# Altium schematic sheet 3_PWR.schdoc
size 309 x 223 mm; Symbol: Sheet-Symbol_A4; Device: Sheet-Symbol_A4; Company: EasyEDA.com; Drawed: EasyEDA Pro; Reviewed: EasyEDA Pro; Version: V0.1; Page Size: A4; @Project Name: Robomama_ver000; @Page Count: 5; @Update Date: 2024-01-30; @Create Date: 2024-01-06; @Schematic Name: Robomama_Schematic; Part Number: JLCPCB-002; @Page No: 3; @Page Name: PWR
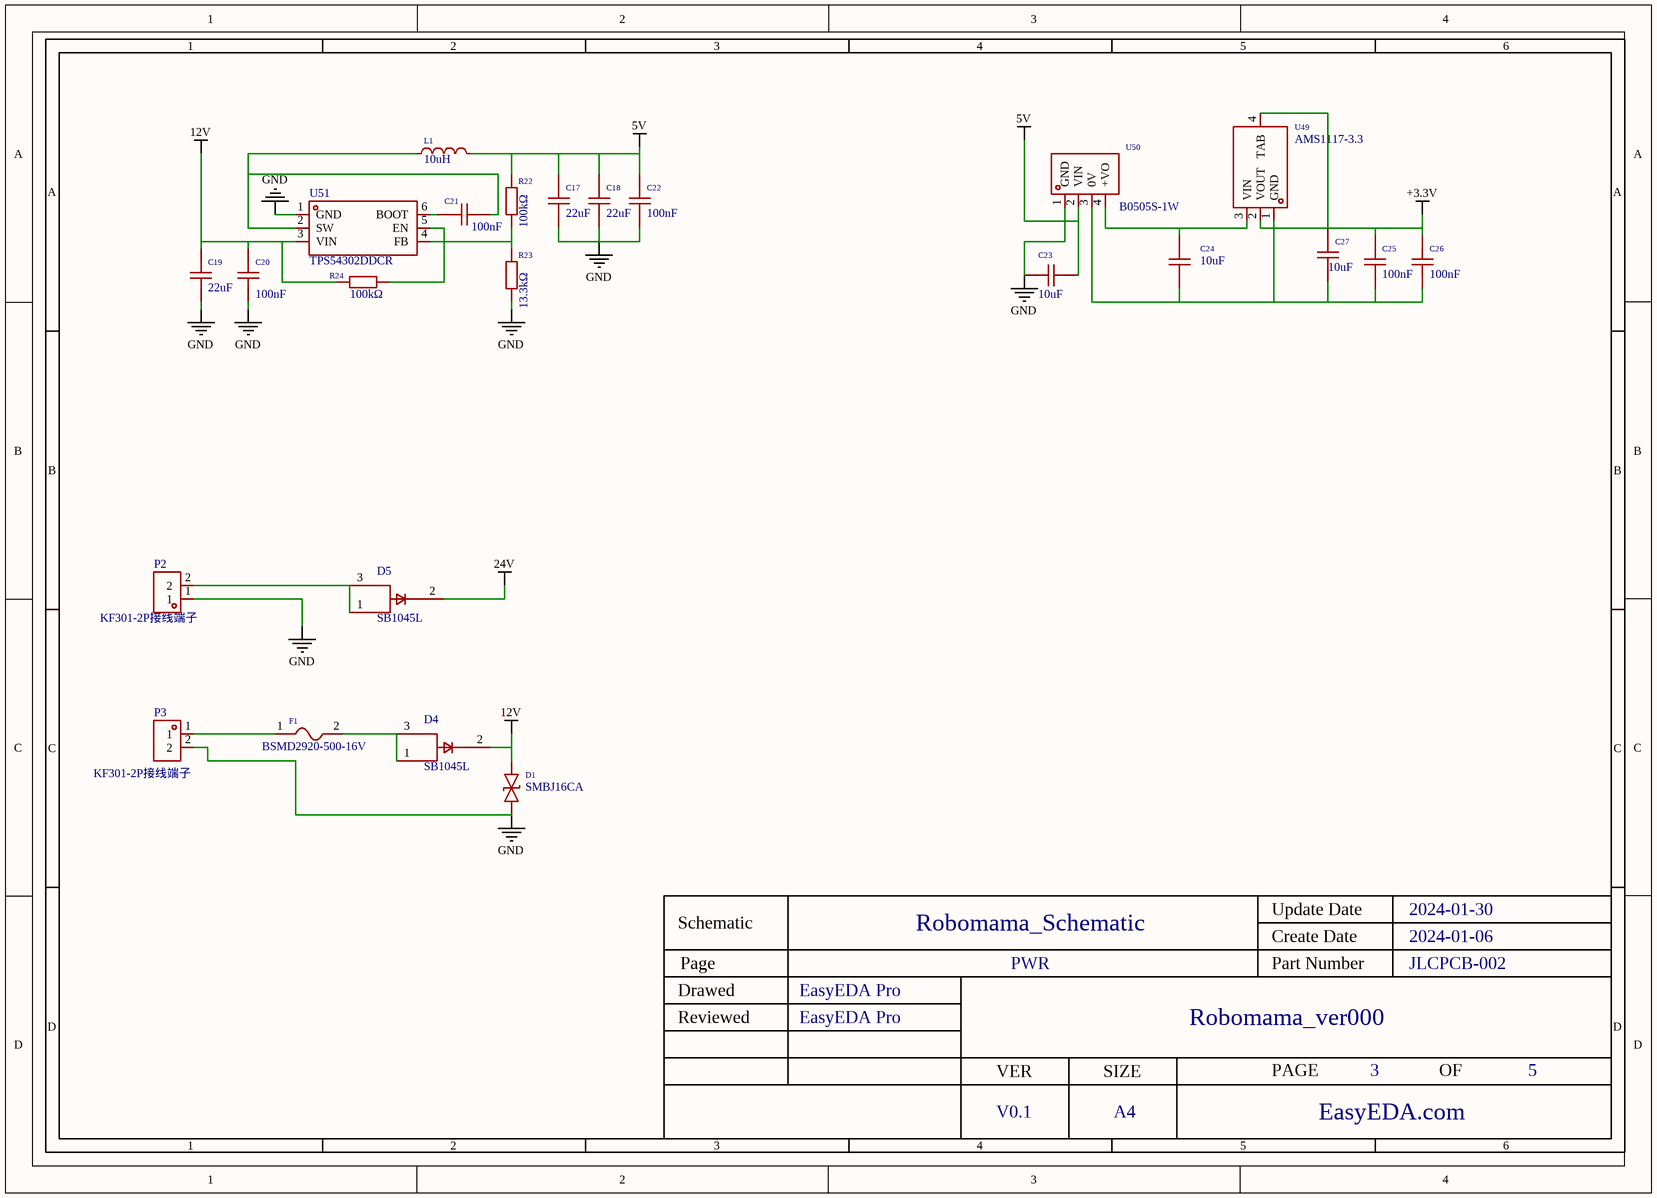
[diagram p0: 3_PWR.schdoc]

## Parts
C17  22uF  [C0805]  (value not drawn)
C18  22uF  [C0805]  (value not drawn)
C19  22uF  [C0805]  (value not drawn)
C20  100nF  [C0603]  (value not drawn)
C21  100nF  [C0603]  (value not drawn)
C22  100nF  [C0603]  (value not drawn)
C23  10uF  [C0603]  (value not drawn)
C24  10uF  [C0603]  (value not drawn)
C25  100nF  [C0603]  (value not drawn)
C26  100nF  [C0603]  (value not drawn)
C27  10uF  [C0603]  (value not drawn)
D1  SMBJ16CA  [SMB_L4.3-W3.6-LS5.4-BI]  (value not drawn)
D4  SB1045L  [TO-277_3P-L5.4-W4.0-LS6.5-TR]  (value not drawn)
D5  SB1045L  [TO-277_3P-L5.4-W4.0-LS6.5-TR]  (value not drawn)
F1  BSMD2920-500-16V  [F2920]  (value not drawn)
L1  10uH  [IND-SMD_L7.3-W6.8]  (value not drawn)
P2  KF301-2P接线端子  [CONN-TH_XY301V-A-5.0-2P]  (value not drawn)
P3  KF301-2P接线端子  [CONN-TH_XY301V-A-5.0-2P]  (value not drawn)
R22  100kΩ  [R0603]  (value not drawn)
R23  13.3kΩ  [R0603]  (value not drawn)
R24  100kΩ  [R0603]  (value not drawn)
U49  AMS1117-3.3  [SOT-223-3_L6.5-W3.4-P2.30-LS7.0-BR]  (value not drawn)
U50  B0505S-1W  [PWRM-TH_B0505S-1W]  (value not drawn)
U51  TPS54302DDCR  [SOT-23-6_L2.9-W1.6-P0.95-LS2.8-BL]  (value not drawn)

## Nets
5V: C17.2 C18.1 C22.1 C23.1 L1.2 R22.2 U50.2(VIN)
12V: C19.2 C20.2 D1.2 D4.2(K) R24.2 U51.3(VIN)
24V: D5.2(K)
+3.3V: C25.1 C26.1 C27.2 U49.2(VOUT) U49.4(TAB)
GND: C17.1 C18.2 C19.1 C20.1 C22.2 C23.2 D1.1 P2.1 P3.2 R23.1 U50.1(GND) U51.1(GND)
NetC21_1: C21.1 L1.1 U51.2(SW)
NetC21_2: C21.2 U51.6(BOOT)
NetC24_1: C24.1 C25.2 C26.2 C27.1 U49.1(GND) U50.3(0V)
NetC24_2: C24.2 U49.3(VIN) U50.4(+VO)
NetD4_1: D4.1(A) D4.3(A) F1.2
NetD5_1: D5.1(A) D5.3(A) P2.2
NetF1_1: F1.1 P3.1
NetR22_1: R22.1 R23.2 U51.4(FB)
NetR24_1: R24.1 U51.5(EN)

## Notes on the sheet
- 1
- 2
- 3
- 4
- 5
- 6
- A
- B
- C
- Schematic
- Robomama_Schematic
- Create Date
- Update Date
- 2024-01-30
- 2024-01-06
- Reviewed
- Drawed
- Page
- EasyEDA Pro
- PWR
- Part Number
- Robomama_ver000
- JLCPCB-002
- D
- VER
- SIZE
- PAGE
- OF
- V0.1
- A4
- EasyEDA.com

## Library data of the parts
C17-C19 = CL21A226MAQNNNE_C45783: Capacitance: Tolerance:±20% Tolerance:±20% Voltage Rated: Temperature Coefficient:; Manufacturer: SAMSUNG(三星); Add into BOM: yes; Tolerance: ±20%; Symbol: CL21A226MAQNNNE; Device: CL21A226MAQNNNE_C45783; Supplier: LCSC; Manufacturer Part: CL21A226MAQNNNE; Value: 22uF; Supplier Part: C45783; JLCPCB Part Class: Basic Part; LCSC Part Name: 22uF ±20% 25V; Supplier Footprint: 0805; Datasheet: https://atta.szlcsc.com/upload/public/pdf/source/20160218/1457707763339.pdf; Convert to PCB: yes
C20-C22 C25 C26 = CC0603KRX7R9BB104: Capacitance: Tolerance:±10% Tolerance:±10% Voltage Rated: Temperature Coefficient:; Manufacturer: YAGEO(国巨); Add into BOM: yes; Tolerance: ±10%; Symbol: CC0603KRX7R9BB104; Device: CC0603KRX7R9BB104; Supplier: LCSC; Manufacturer Part: CC0603KRX7R9BB104; Value: 100nF; Supplier Part: C14663; JLCPCB Part Class: Basic Part; LCSC Part Name: 100nF ±10% 50V; Supplier Footprint: 0603; Datasheet: https://atta.szlcsc.com/upload/public/pdf/source/20180910/C282072_33301C7F631E79921B82A8DAC6BCC5B3.pdf; Convert to PCB: yes
C23 C24 C27 = CL10A106KP8NNNC: Capacitance: Tolerance:±10% Tolerance:±10% Voltage Rated: Temperature Coefficient:; Manufacturer: SAMSUNG(三星); Add into BOM: yes; Tolerance: ±10%; Symbol: CL10A106KP8NNNC; Device: CL10A106KP8NNNC; Supplier: LCSC; Manufacturer Part: CL10A106KP8NNNC; Value: 10uF; Supplier Part: C19702; JLCPCB Part Class: Basic Part; LCSC Part Name: 10uF ±10% 10V; Supplier Footprint: 0603; Datasheet: https://atta.szlcsc.com/upload/public/pdf/source/20160218/1457707763339.pdf; Convert to PCB: yes
D1 = SMBJ16CA_C194302: Reverse Stand-Off Voltage (Vrwm):16V Maximum Clamping Voltage:26V Peak Pulse Current (Ipp)@10/1000us:23.1A Breakdown Voltage:17.8V Reverse Leakage Current (Ir):1uA Type:TVS; Manufacturer: Brightking(君耀电子); Add into BOM: yes; Reverse Stand-Off Voltage (Vrwm): 16V; Maximum Clamping Voltage: 26V; Peak Pulse Current (Ipp)@10/1000us: 23.1A; Breakdown Voltage: 17.8V; Reverse Leakage Current (Ir): 1uA; Type: TVS; Symbol: SMBJ16CA_C194302; Device: SMBJ16CA_C194302; Supplier: LCSC; Supplier Part: C194302; Manufacturer Part: SMBJ16CA; JLCPCB Part Class: Extended Part; LCSC Part Name: SMBJ16CA; Supplier Footprint: SMB(DO-214AA); Datasheet: https://atta.szlcsc.com/upload/public/pdf/source/20181114/C309994_0BBF6B3C1D339796B104E4710E56EEA8.pdf; Convert to PCB: yes
D4 D5 = SB1045L_C113945: Reverse Voltage (Vr):45V Average Rectified Current (Io):10A Forward Voltage (Vf@If):530mV@10A; Manufacturer: MDD; Add into BOM: yes; Reverse Voltage (Vr): 45V; Average Rectified Current (Io): 10A; Symbol: SB1045L; Device: SB1045L_C113945; LCSC Part Name: 45V 10A 530mV@10A; Supplier Part: C113945; Manufacturer Part: SB1045L; Supplier Footprint: TO-277; JLCPCB Part Class: Extended Part; Datasheet: https://atta.szlcsc.com/upload/public/pdf/source/20180308/C113945_15204885390131413776.pdf; Supplier: LCSC; Convert to PCB: yes; Forward Voltage (Vf@If): 530mV@10A
F1 = BSMD2920-500-16V: Operating Voltage (Max):16V Current Rating (Max):40A Hold Current:5A Trip Current:10A Power Dissipation:2W Resistance - Initial (Ri) (Min):5mΩ Resistance - Post Trip (R1) (Max):31mΩ Maximum Time to Trip:5s Operating Temperature:-40℃~+85℃ Operating Tempera; Manufacturer: BHFUSE(佰宏); Add into BOM: yes; Operating Voltage (Max): 16V; Current Rating (Max): 40A; Hold Current: 5A; Trip Current: 10A; Power Dissipation: 2W; Resistance - Initial (Ri) (Min): 5mΩ; Resistance - Post Trip (R1) (Max): 31mΩ; Maximum Time to Trip: 5s; Symbol: BSMD2920-500-16V; Device: BSMD2920-500-16V; Supplier: LCSC; Supplier Part: C910846; Manufacturer Part: BSMD2920-500-16V; JLCPCB Part Class: Extended Part; LCSC Part Name: 16V 5A 2920自恢复; Supplier Footprint: 2920; Datasheet: https://atta.szlcsc.com/upload/public/pdf/source/20230512/D022CCFE0A7F15633C929F419B252442.pdf; Convert to PCB: yes; Operating Temperature: -40℃~+85℃
L1 = FXL0630-100-M: Inductance: Tolerance:±20% Tolerance:±20% Rated Current: Type:一体成型电感 DC Resistance (DCR): Saturation Current (Isat):5.5A Ratings:-; Manufacturer: cjiang(长江微电); Add into BOM: yes; Tolerance: ±20%; Type: 一体成型电感; Saturation Current (Isat): 5.5A; Symbol: FXL0630-100-M; Device: FXL0630-100-M; Supplier: LCSC; Manufacturer Part: FXL0630-100-M; Value: 10uH; Supplier Part: C167223; JLCPCB Part Class: Extended Part; LCSC Part Name: 10uH ±20% 5.5A; Supplier Footprint: SMD,6.6x7mm; Datasheet: https://atta.szlcsc.com/upload/public/pdf/source/20230516/3A080F5AF8C87BB81C3BA86E5F60E51A.pdf; Convert to PCB: yes; Ratings: -
P2 P3 = KF301-2P接线端子: Add into BOM: yes; Symbol: KF301-2P接线端子; Device: KF301-2P接线端子; LCSC Part Name: KF301-2P接线端子; Supplier Part: C9900016950; Manufacturer Part: KF301-2P接线端子; Supplier Footprint: CK301-2P; JLCPCB Part Class: Extended Part; Datasheet: https://atta.szlcsc.comnull; Supplier: LCSC; Convert to PCB: yes
R22 R24 = 0603WAF1003T5E: Resistance:100000Ω Tolerance:±1% Tolerance:±1% Power(Watts): Overload Voltage (Max): Temperature Coefficient:±100ppm/℃ Temperature Coefficient:±100ppm/℃ Type:Thick Film Resistors Operating Temperature Range:-55℃~+155℃ Operating Temperature Range:-55℃~+155; Manufacturer: UNI-ROYAL(厚声); Add into BOM: yes; Tolerance: ±1%; Symbol: 0603WAF1003T5E; Device: 0603WAF1003T5E; Supplier: LCSC; Manufacturer Part: 0603WAF1003T5E; Supplier Part: C25803; Value: 100kΩ; JLCPCB Part Class: Basic Part; LCSC Part Name: 100kΩ ±1% 100mW 厚膜电阻; Supplier Footprint: 0603; Datasheet: https://atta.szlcsc.com/upload/public/pdf/source/20200306/C422600_1E6D84923E4A46A82E41ADD87F860B5C.pdf; Convert to PCB: yes; Temperature Coefficient: ±100ppm/℃; Type: Thick Film Resistors; Operating Temperature Range: -55℃~+155℃
R23 = 0603WAF1332T5E: Resistance:13300Ω Tolerance:±1% Tolerance:±1% Power(Watts): Overload Voltage (Max): Temperature Coefficient:±100ppm/℃ Temperature Coefficient:±100ppm/℃ Type:Thick Film Resistors Operating Temperature Range:-55℃~+155℃ Operating Temperature Range:-55℃~+155℃; Manufacturer: UNI-ROYAL(厚声); Add into BOM: yes; Tolerance: ±1%; Symbol: 0603WAF1332T5E; Device: 0603WAF1332T5E; Supplier: LCSC; Manufacturer Part: 0603WAF1332T5E; Supplier Part: C25952; Value: 13.3kΩ; JLCPCB Part Class: Extended Part; LCSC Part Name: 13.3kΩ ±1% 100mW 厚膜电阻; Supplier Footprint: 0603; Datasheet: https://atta.szlcsc.com/upload/public/pdf/source/20200306/C422600_1E6D84923E4A46A82E41ADD87F860B5C.pdf; Convert to PCB: yes; Temperature Coefficient: ±100ppm/℃; Type: Thick Film Resistors; Operating Temperature Range: -55℃~+155℃
U49 = AMS1117-3.3_C351784: Output Type: Maximum Input Voltage:18V Output Voltage:3.3V Output Voltage:3.3V MAX Output Current:800mA Power Supply Rejection Ratio (PSRR):- Dropout Voltage:1.4V@(1A) Output Polarity:Positive electrode Number of Outputs:1; Manufacturer: PUOLOP(迪浦); Add into BOM: yes; Maximum Input Voltage: 18V; Output Voltage: 3.3V; MAX Output Current: 800mA; Number of Outputs: 1; Symbol: AMS1117-3.3_C351784; Device: AMS1117-3.3_C351784; Supplier: LCSC; Supplier Part: C351784; Manufacturer Part: AMS1117-3.3; JLCPCB Part Class: Extended Part; LCSC Part Name: 输入18V 输出3.3V 800mA; Supplier Footprint: SOT-223-3; Datasheet: https://atta.szlcsc.com/upload/public/pdf/source/20210915/EA806799CEEC3F52E0A4FA8303A508AC.pdf; Convert to PCB: yes; Power Supply Rejection Ratio (PSRR): -; Dropout Voltage: 1.4V@(1A); Output Polarity: Positive electrode
U50 = B0505S-1W_C2912568: Conversion Type:DC-DC Function:- Input Voltage(DC):4.5V~5.5V Input Voltage(DC):4.5V~5.5V Output Voltage:5V Output Voltage:5V Output Current (Max):200mA Output Current (Max):200mA Output Channel:1; Manufacturer: DEXU(德旭电子); Add into BOM: yes; Conversion Type: DC-DC; Output Voltage: 5V; Output Current (Max): 200mA; Output Channel: 1; Symbol: B0505S-1W_C2912568; Device: B0505S-1W_C2912568; Supplier: LCSC; Supplier Part: C2912568; Manufacturer Part: B0505S-1W; JLCPCB Part Class: Extended Part; LCSC Part Name: B0505S-1W; Supplier Footprint: 插件; Datasheet: https://atta.szlcsc.com/upload/public/pdf/source/20211027/5CA00AAE5BD3B5061BF0CC10C720A2B7.pdf; Convert to PCB: yes; Function: -; Input Voltage(DC): 4.5V~5.5V
U51 = TPS54302DDCR_C311983: Function:Step-down type Synchronous Rectification:Yes Output Type:Adjustable Number of Outputs:1 Topology:Step-down Input Voltage:4.5V~28V Input Voltage:4.5V~28V Output Voltage:0.596V~28V Output Voltage:0.596V~28V Output Current (Max):3A Switching Frequen; Manufacturer: TI(德州仪器); Add into BOM: yes; Number of Outputs: 1; Output Current (Max): 3A; Switching Frequency: 400kHz; Symbol: TPS54302DDCR_C311983; Device: TPS54302DDCR_C311983; LCSC Part Name: 降压型 输入4.5V~28V 输出596mV~28V 3A; Supplier Part: C311983; Manufacturer Part: TPS54302DDCR; Supplier Footprint: TSOT-23-6; JLCPCB Part Class: Extended Part; Datasheet: https://atta.szlcsc.com/upload/public/pdf/source/20181023/C311983_0948EE70BFAD2011B492BD3F4CEA709D.pdf; Supplier: LCSC; Convert to PCB: yes; Function: Step-down type; Synchronous Rectification: Yes; Output Type: Adjustable; Topology: Step-down; Input Voltage: 4.5V~28V; Output Voltage: 0.596V~28V; Operating Temperature: -40℃~+125℃@(TJ)